# EAGLE design Shield433Rx (EAGLE 5.09)
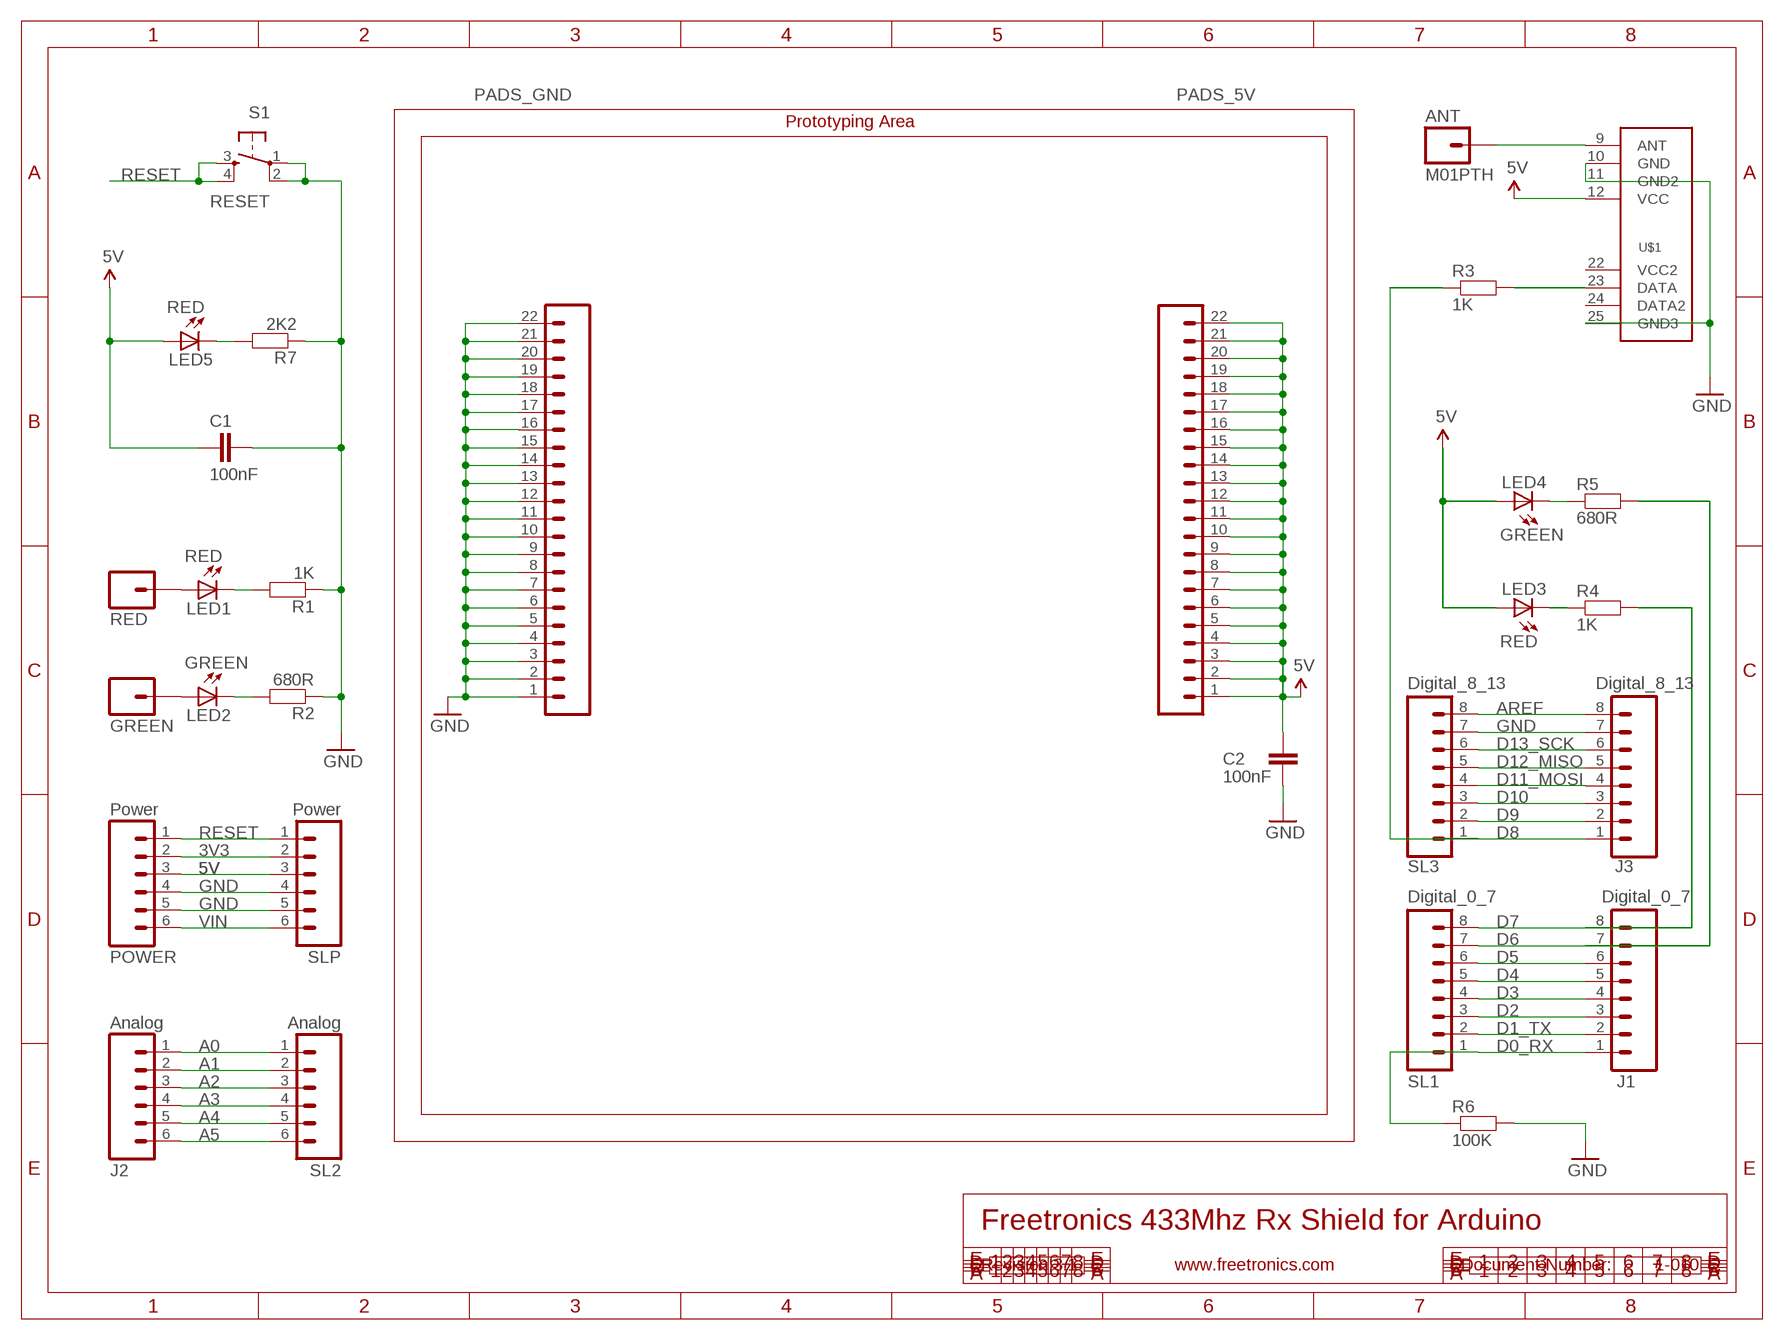
[diagram p0: schematic, sheet 1]

## Parts
ANT  M01PTH  [1X01]
C1  100nF  CAP0603  [0603]
C2  100nF  CAP0603  [0603]
GREEN  M01PTH  [1X01]
J1  Digital_0_7  M08  [1X08]
J2  Analog  M06SIP  [1X06]
J3  Digital_8_13  M08  [1X08]
LED1  RED  LED0603  [LED-0603]
LED2  GREEN  LED0603  [LED-0603]
LED3  RED  LED0603  [LED-0603]
LED4  GREEN  LED0603  [LED-0603]
LED5  RED  LED0603  [LED-0603]
PADS_5V  M22SIP-22  [SIP-22]
PADS_GND  M22SIP-22  [SIP-22]
POWER  Power  M06SIP  [1X06]
R1  1K  RESISTOR0603  [0603]
R2  680R  RESISTOR0603  [0603]
R3  1K  RESISTOR0603  [0603]
R4  1K  RESISTOR0603  [0603]
R5  680R  RESISTOR0603  [0603]
R6  100K  RESISTOR0603  [0603]
R7  2K2  RESISTOR0603  [0603]
RED  M01PTH  [1X01]
S1  RESET  BUTTON-TACTILESMT  [BUTTON-TACTILE-SMT]
SL1  Digital_0_7  M08  [1X08]
SL2  Analog  M06SIP  [1X06]
SL3  Digital_8_13  M08  [1X08]
SLP  Power  M06SIP  [1X06]
U$1  RXB1SIL  [RX-B1]

## Nets
3V3: POWER.2 SLP.2
5V: C1.1 C2.1 LED3.A LED4.A LED5.A PADS_5V.1 PADS_5V.2 PADS_5V.3 PADS_5V.4 PADS_5V.5 PADS_5V.6 PADS_5V.7 PADS_5V.8 PADS_5V.9 PADS_5V.10 PADS_5V.11 PADS_5V.12 PADS_5V.13 PADS_5V.14 PADS_5V.15 PADS_5V.16 PADS_5V.17 PADS_5V.18 PADS_5V.19 PADS_5V.20 PADS_5V.21 PADS_5V.22 POWER.3 SLP.3 U$1.12(VCC)
A0: J2.1 SL2.1
A1: J2.2 SL2.2
A2: J2.3 SL2.3
A3: J2.4 SL2.4
A4: J2.5 SL2.5
A5: J2.6 SL2.6
AREF: J3.8 SL3.8
D0_RX: J1.1 R6.1 SL1.1
D1_TX: J1.2 SL1.2
D2: J1.3 SL1.3
D3: J1.4 SL1.4
D4: J1.5 SL1.5
D5: J1.6 SL1.6
D6: J1.7 R5.2 SL1.7
D7: J1.8 R4.2 SL1.8
D8: J3.1 R3.1 SL3.1
D9: J3.2 SL3.2
D10: J3.3 SL3.3
D11_MOSI: J3.4 SL3.4
D12_MISO: J3.5 SL3.5
D13_SCK: J3.6 SL3.6
GND: C1.2 C2.2 J3.7 PADS_GND.1 PADS_GND.2 PADS_GND.3 PADS_GND.4 PADS_GND.5 PADS_GND.6 PADS_GND.7 PADS_GND.8 PADS_GND.9 PADS_GND.10 PADS_GND.11 PADS_GND.12 PADS_GND.13 PADS_GND.14 PADS_GND.15 PADS_GND.16 PADS_GND.17 PADS_GND.18 PADS_GND.19 PADS_GND.20 PADS_GND.21 PADS_GND.22 POWER.4 POWER.5 R1.1 R2.1 R6.2 R7.1 S1.1 S1.2 SL3.7 SLP.4 SLP.5 U$1.10(GND) U$1.11(GND2) U$1.25(GND3)
N$1: LED1.C R1.2
N$2: LED1.A RED.1
N$3: LED2.C R2.2
N$4: GREEN.1 LED2.A
N$6: ANT.1 U$1.9(ANT)
N$134: LED4.C R5.1
N$135: R3.2 U$1.23(DATA)
N$137: LED3.C R4.1
N$140: LED5.C R7.2
RESET: POWER.1 S1.3 S1.4 SLP.1
VIN: POWER.6 SLP.6
Unconnected: U$1.22(VCC2) U$1.24(DATA2)

## Notes on the sheet
- Prototyping Area
- Freetronics 433Mhz Rx Shield for Arduino
- Revision 3.1 | www.freetronics.com | Document Number: | 1-010

## Library data of the parts
ANT GREEN RED = freetronics:M01: Header 1 Standard 1-pin 0.1" header. Use with straight break away headers (SKU : PRT-00116), right angle break away headers (PRT-00553), swiss pins (PRT-00743), machine pins (PRT-00117), and female headers (PRT-00115).
C1 C2 = freetronics:CAP: Capacitor Standard 0603 ceramic capacitor, and 0.1" leaded capacitor.
J1 J3 SL1 SL3 = freetronics:M08: Header 8 Standard 8-pin 0.1" header. Use with straight break away headers (SKU : PRT-00116), right angle break away headers (PRT-00553), swiss pins (PRT-00743), machine pins (PRT-00117), and female headers (PRT-00115).
J2 POWER SL2 SLP = freetronics:M06: Header 6 Standard 6-pin 0.1" header. Use with straight break away headers (SKU : PRT-00116), right angle break away headers (PRT-00553), swiss pins (PRT-00743), machine pins (PRT-00117), and female headers (PRT-00115). Molex polarized connector foot print use with SKU : PRT-08094 with associated crimp pins and housings. NOTES ON THE VARIANTS LOCK and LOCK_LONGPADS... This footprint was designed to help hold the alignment of a through-hole component (i.e. 6-pin header) while soldering it into place. You may notice that each hole has been shifted either up or down by 0.005 of an inch from it's more standard position (which is a perfectly straight line). This slight alteration caused the pins (the squares in the middle) to touch the edges of the holes. Because they are alternating, it causes a "brace" to hold the component in place. 0.005 has proven to be the perfect amount of "off-center" position when using our standard breakaway headers. Although looks a little odd when you look at the bare footprint, once you have a header in there, the alteration is very hard to notice. Also, if you push a header all the way into place, it is covered up entirely on the bottom side. This idea of altering the position of holes to aid alignment will be further integrated into the Sparkfun Library for other footprints. It can help hold any component with 3 or more connection pins.
LED1-LED5 = freetronics:LED: LEDs Standard schematic elements and footprints for 5mm, 3mm, 1206, and 0603 sized LEDs. 5mm - Spark Fun Electronics SKU : COM-00529 (and others)
PADS_5V PADS_GND = PracticalArduino:M22: 22-pin SIP header
R1-R7 = freetronics:RESISTOR: Resistor Basic schematic elements and footprints for 0603, 1206, and PTH 1/10th watt (small) resistors.
S1 = PracticalArduino:BUTTON-TACTILE: Tactile push-button switch
U$1 = PracticalArduino:RXB1

## Board
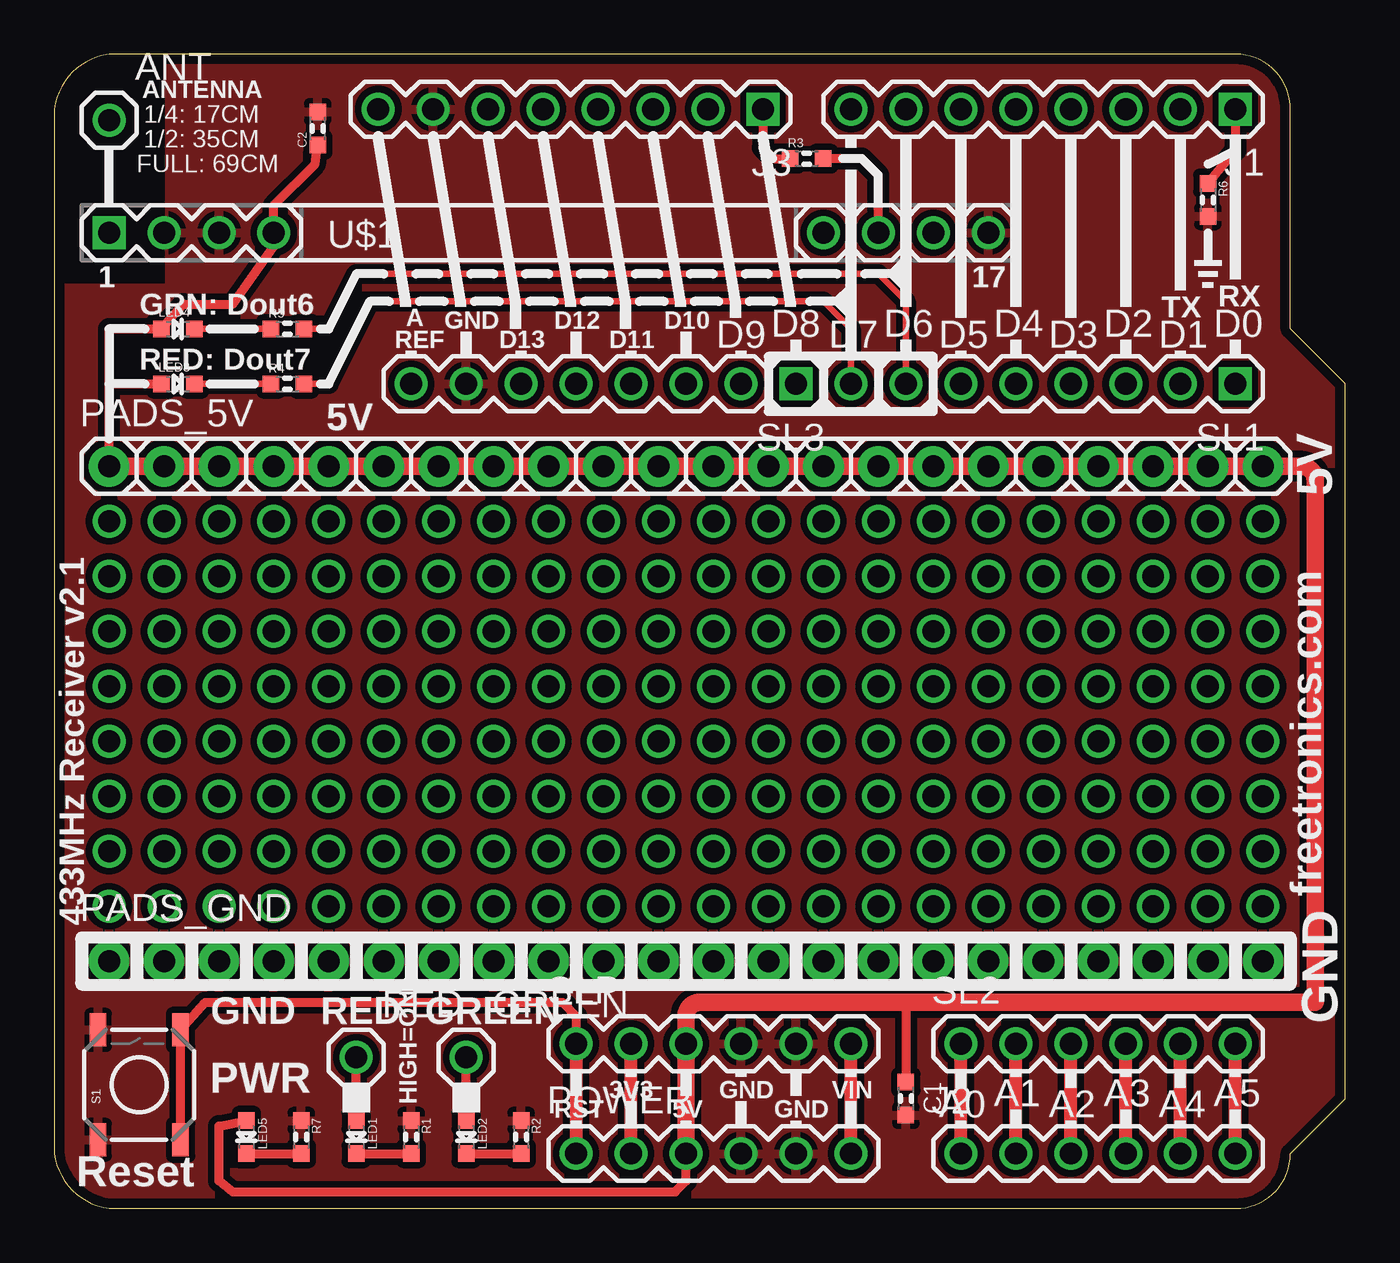
[diagram p1: board, top side]
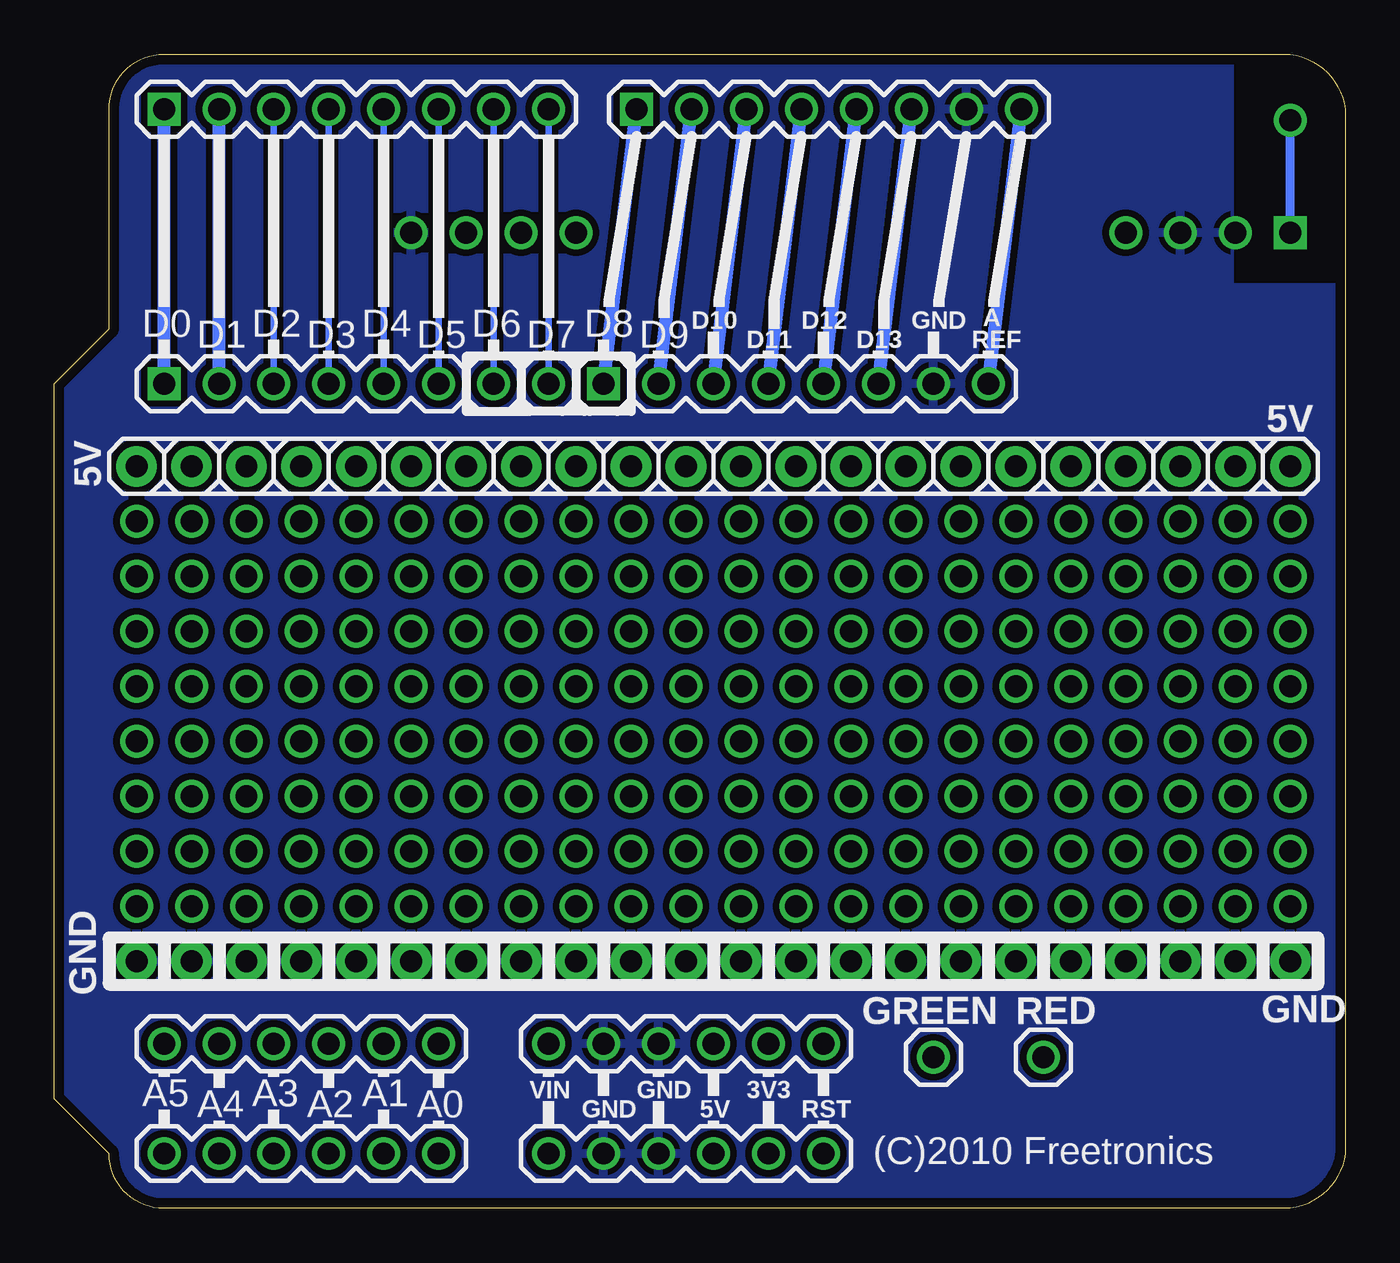
[diagram p2: board, bottom side, seen from below]

Size 59.69 x 53.34 mm. Coordinates in mm from the lower left corner, seen from the top.
Outline: 0,2.54 arc74 2.54,0 54.61,0 arc90 57.15,2.54 59.69,5.08 59.69,38.1 57.15,40.64 57.15,50.8 arc90 54.61,53.34 2.54,53.34 arc74 0,50.8 0,2.54
Copper layers (1*16): Top 0.035mm / dielectric 1.5mm / Bottom 0.035mm
Design rules "default *": minimum track width 10mil, minimum drill 24mil, track to track 12mil, track to pad 12mil, pad to pad 12mil, via to via 12mil, smd to smd 8mil, copper to edge 18mil, drill to drill 8mil, minimum pad ring 10mil, minimum via ring 8mil, stop-mask expansion 4mil, vias tented up to drill 0mil, thermal gap 10mil

### Footprints (pad centres in the part's own frame; a part is rotated, then mirrored left to right if it is on the bottom)
1X01 = drill 1.016 round: 1 0,0
0603 = smd 0.762 x 0.762: 1 -0.762,0; 2 0.762,0
1X08 = drill 1.016 square: 1 0,0 | drill 1.016 round: 2 2.54,0; 3 5.08,0; 4 7.62,0; 5 10.16,0; 6 12.7,0; 7 15.24,0; 8 17.78,0
1X06 = drill 1.016 round: 1 0,0; 2 2.54,0; 3 5.08,0; 4 7.62,0; 5 10.16,0; 6 12.7,0
LED-0603 = smd 0.762 x 0.762: A -0.762,0; C 0.762,0
SIP-22 = drill 1.016 pad 1.88 round: 1 -25.4,0; 2 -22.86,0; 3 -20.32,0; 4 -17.78,0; 5 -15.24,0; 6 -12.7,0; 7 -10.16,0; 8 -7.62,0; 9 -5.08,0; 10 -2.54,0; 11 0,0; 12 2.54,0; 13 5.08,0; 14 7.62,0; 15 10.16,0; 16 12.7,0; 17 15.24,0; 18 17.78,0; 19 20.32,0; 20 22.86,0; 21 25.4,0; 22 27.94,0
BUTTON-TACTILE-SMT = smd 1.524 x 0.762: 1 -2.54,1.905; 2 2.54,1.905; 3 -2.54,-1.905; 4 2.54,-1.905
RX-B1 = drill 1.016 square: 9 -19.05,0 | drill 1.016 round: 10 -16.51,0; 11 -13.97,0; 12 -11.43,0; 22 13.97,0; 23 16.51,0; 24 19.05,0; 25 21.59,0

### Placement (x,y rotation side)
ANT  2.54,50.29 0 top
C1  39.37,5.08 270 top
C2  12.19,49.91 90 top
GREEN  19.05,6.99 0 top
J1  54.61,50.8 180 top
J2  41.91,2.54 0 top
J3  32.77,50.8 180 top
LED1  13.97,3.3 270 top
LED2  19.05,3.3 270 top
LED3  5.71,38.1 0 top
LED4  5.71,40.64 0 top
LED5  8.89,3.3 270 top
PADS_5V  27.94,34.29 0 top
PADS_GND  27.94,11.43 0 top
POWER  24.13,2.54 0 top
R1  16.51,3.3 270 top
R2  21.59,3.3 270 top
R3  34.8,48.51 0 top
R4  10.79,38.1 0 top
R5  10.79,40.64 0 top
R6  53.34,46.61 270 top
R7  11.43,3.3 270 top
RED  13.97,6.99 0 top
S1  3.94,5.71 90 top
SL1  54.61,38.1 180 top
SL2  41.91,7.62 0 top
SL3  34.29,38.1 180 top
SLP  24.13,7.62 0 top
U$1  21.59,45.09 0 top

### Tracks (layer width: path | path; a pad name or v marks a point on that pad's centre or on a via)
3V3
  Top 0.61: POWER.2 SLP.2
5V
  Top 0.305: 3.81,34.29 4.06,34.54
  Top 0.406: 12.06,49.28 C2.1 12.06,48.26 10.16,46.35 U$1.12 10.16,44.45 8.26,41.78 5.97,41.78 LED4.A 2.54,40.64 2.54,38.1 | PADS_5V.1 2.54,38.1 | 2.54,38.1 LED3.A | 39.37,9.53 C1.1 | POWER.3 29.21,1.27 28.7,0.76 8.26,0.76 7.62,1.27 7.62,3.81 LED5.A
  Top 0.813: POWER.3 SLP.3 29.21,8.89 arc-90 29.84,9.53 39.37,9.53 58.29,9.53 58.29,33.66 arc90 57.66,34.29 PADS_5V.22 PADS_5V.21 PADS_5V.20 PADS_5V.19 PADS_5V.18 PADS_5V.17 PADS_5V.16 PADS_5V.15 PADS_5V.14 PADS_5V.13 PADS_5V.12 PADS_5V.11 PADS_5V.10 PADS_5V.9 PADS_5V.8 PADS_5V.7 PADS_5V.6 PADS_5V.5 PADS_5V.4 PADS_5V.3 PADS_5V.2 PADS_5V.1 3.81,34.29
A0
  Top 0.61: J2.1 SL2.1
A1
  Top 0.61: J2.2 SL2.2
A2
  Top 0.61: J2.3 SL2.3
A3
  Top 0.61: J2.4 SL2.4
A4
  Top 0.61: J2.5 SL2.5
A5
  Top 0.61: J2.6 SL2.6
AREF
  Bottom 0.61: SL3.8 J3.8
D0_RX
  Top 0.406: R6.1 54.61,48.9 J1.1
  Bottom 0.61: SL1.1 J1.1
D1_TX
  Bottom 0.61: SL1.2 J1.2
D2
  Bottom 0.305: SL1.3 J1.3
D3
  Bottom 0.305: SL1.4 J1.4
D4
  Bottom 0.305: SL1.5 J1.5
D5
  Bottom 0.305: SL1.6 J1.6
D6
  Top 0.305: SL1.7 39.37,41.91 38.1,43.18 13.97,43.18 12.7,40.64 R5.2
  Bottom 0.305: SL1.7 J1.7
D7
  Top 0.305: R4.2 12.7,38.1 14.61,41.91 35.56,41.91 36.83,40.64 SL1.8
  Bottom 0.305: SL1.8 J1.8
D8
  Top 0.406: J3.1 32.77,49.02 33.27,48.51 R3.1
  Bottom 0.61: SL3.1 J3.1
D9
  Bottom 0.61: SL3.2 J3.2
D10
  Bottom 0.61: SL3.3 J3.3
D11_MOSI
  Bottom 0.61: SL3.4 J3.4
D12_MISO
  Bottom 0.61: SL3.5 J3.5
D13_SCK
  Bottom 0.61: SL3.6 J3.6
GND
  pour Bottom: 0,42.55 5.33,42.55 5.33,53.34 54.61,53.34 arc-74 57.15,50.8 57.15,40.64 59.69,38.1 59.69,5.08 57.15,2.54 arc-74 54.61,0 2.54,0 arc-74 0,2.54
  pour Top: 0,42.55 5.33,42.55 5.33,53.34 54.61,53.34 arc-74 57.15,50.8 57.15,40.64 59.69,38.1 59.69,5.08 57.15,2.54 arc-74 54.61,0 2.54,0 arc-74 0,2.54
N$1
  Top 0.406: LED1.C R1.2
N$2
  Top 0.406: LED1.A RED.1
N$3
  Top 0.406: LED2.C R2.2
N$4
  Top 0.406: LED2.A GREEN.1
N$5  (via drill 1.02)
  other vias: 50.8,13.97
N$6
  Bottom 0.406: U$1.9 ANT.1
N$7  (via drill 1.02)
  other vias: 48.26,13.97
N$8  (via drill 1.02)
  other vias: 45.72,13.97
N$9  (via drill 1.02)
  other vias: 43.18,13.97
N$10  (via drill 1.02)
  other vias: 40.64,13.97
N$11  (via drill 1.02)
  other vias: 38.1,13.97
N$12  (via drill 1.02)
  other vias: 35.56,13.97
N$13  (via drill 1.02)
  other vias: 33.02,13.97
N$14  (via drill 1.02)
  other vias: 30.48,13.97
N$15  (via drill 1.02)
  other vias: 27.94,13.97
N$16  (via drill 1.02)
  other vias: 25.4,13.97
N$17  (via drill 1.02)
  other vias: 22.86,13.97
N$18  (via drill 1.02)
  other vias: 20.32,13.97
N$19  (via drill 1.02)
  other vias: 17.78,13.97
N$20  (via drill 1.02)
  other vias: 15.24,13.97
N$21  (via drill 1.02)
  other vias: 12.7,13.97
N$22  (via drill 1.02)
  other vias: 50.8,16.51
N$23  (via drill 1.02)
  other vias: 48.26,16.51
N$24  (via drill 1.02)
  other vias: 45.72,16.51
N$25  (via drill 1.02)
  other vias: 43.18,16.51
N$26  (via drill 1.02)
  other vias: 40.64,16.51
N$27  (via drill 1.02)
  other vias: 38.1,16.51
N$28  (via drill 1.02)
  other vias: 35.56,16.51
N$29  (via drill 1.02)
  other vias: 33.02,16.51
N$30  (via drill 1.02)
  other vias: 30.48,16.51
N$31  (via drill 1.02)
  other vias: 27.94,16.51
N$32  (via drill 1.02)
  other vias: 25.4,16.51
N$33  (via drill 1.02)
  other vias: 22.86,16.51
N$34  (via drill 1.02)
  other vias: 20.32,16.51
N$35  (via drill 1.02)
  other vias: 17.78,16.51
N$36  (via drill 1.02)
  other vias: 15.24,16.51
N$37  (via drill 1.02)
  other vias: 12.7,16.51
N$38  (via drill 1.02)
  other vias: 50.8,19.05
N$39  (via drill 1.02)
  other vias: 48.26,19.05
N$40  (via drill 1.02)
  other vias: 45.72,19.05
N$41  (via drill 1.02)
  other vias: 43.18,19.05
N$42  (via drill 1.02)
  other vias: 40.64,19.05
N$43  (via drill 1.02)
  other vias: 38.1,19.05
N$44  (via drill 1.02)
  other vias: 35.56,19.05
N$45  (via drill 1.02)
  other vias: 33.02,19.05
N$46  (via drill 1.02)
  other vias: 30.48,19.05
N$47  (via drill 1.02)
  other vias: 27.94,19.05
N$48  (via drill 1.02)
  other vias: 25.4,19.05
N$49  (via drill 1.02)
  other vias: 22.86,19.05
N$50  (via drill 1.02)
  other vias: 20.32,19.05
N$51  (via drill 1.02)
  other vias: 17.78,19.05
N$52  (via drill 1.02)
  other vias: 15.24,19.05
N$53  (via drill 1.02)
  other vias: 12.7,19.05
N$54  (via drill 1.02)
  other vias: 50.8,21.59
N$55  (via drill 1.02)
  other vias: 48.26,21.59
N$56  (via drill 1.02)
  other vias: 45.72,21.59
N$57  (via drill 1.02)
  other vias: 43.18,21.59
N$58  (via drill 1.02)
  other vias: 40.64,21.59
N$59  (via drill 1.02)
  other vias: 38.1,21.59
N$60  (via drill 1.02)
  other vias: 35.56,21.59
N$61  (via drill 1.02)
  other vias: 33.02,21.59
N$62  (via drill 1.02)
  other vias: 30.48,21.59
N$63  (via drill 1.02)
  other vias: 27.94,21.59
N$64  (via drill 1.02)
  other vias: 25.4,21.59
N$65  (via drill 1.02)
  other vias: 22.86,21.59
N$66  (via drill 1.02)
  other vias: 20.32,21.59
N$67  (via drill 1.02)
  other vias: 17.78,21.59
N$68  (via drill 1.02)
  other vias: 15.24,21.59
N$69  (via drill 1.02)
  other vias: 12.7,21.59
N$70  (via drill 1.02)
  other vias: 50.8,24.13
N$71  (via drill 1.02)
  other vias: 48.26,24.13
N$72  (via drill 1.02)
  other vias: 45.72,24.13
N$73  (via drill 1.02)
  other vias: 43.18,24.13
N$74  (via drill 1.02)
  other vias: 40.64,24.13
N$75  (via drill 1.02)
  other vias: 38.1,24.13
N$76  (via drill 1.02)
  other vias: 35.56,24.13
N$77  (via drill 1.02)
  other vias: 33.02,24.13
N$78  (via drill 1.02)
  other vias: 30.48,24.13
N$79  (via drill 1.02)
  other vias: 27.94,24.13
N$80  (via drill 1.02)
  other vias: 25.4,24.13
N$81  (via drill 1.02)
  other vias: 22.86,24.13
N$82  (via drill 1.02)
  other vias: 20.32,24.13
N$83  (via drill 1.02)
  other vias: 17.78,24.13
N$84  (via drill 1.02)
  other vias: 15.24,24.13
N$85  (via drill 1.02)
  other vias: 12.7,24.13
N$86  (via drill 1.02)
  other vias: 50.8,26.67
N$87  (via drill 1.02)
  other vias: 48.26,26.67
N$88  (via drill 1.02)
  other vias: 45.72,26.67
N$89  (via drill 1.02)
  other vias: 43.18,26.67
N$90  (via drill 1.02)
  other vias: 40.64,26.67
N$91  (via drill 1.02)
  other vias: 38.1,26.67
N$92  (via drill 1.02)
  other vias: 35.56,26.67
N$93  (via drill 1.02)
  other vias: 33.02,26.67
N$94  (via drill 1.02)
  other vias: 30.48,26.67
N$95  (via drill 1.02)
  other vias: 27.94,26.67
N$96  (via drill 1.02)
  other vias: 25.4,26.67
N$97  (via drill 1.02)
  other vias: 22.86,26.67
N$98  (via drill 1.02)
  other vias: 20.32,26.67
N$99  (via drill 1.02)
  other vias: 17.78,26.67
N$100  (via drill 1.02)
  other vias: 15.24,26.67
N$101  (via drill 1.02)
  other vias: 12.7,26.67
N$102  (via drill 1.02)
  other vias: 50.8,29.21
N$103  (via drill 1.02)
  other vias: 48.26,29.21
N$104  (via drill 1.02)
  other vias: 45.72,29.21
N$105  (via drill 1.02)
  other vias: 43.18,29.21
N$106  (via drill 1.02)
  other vias: 40.64,29.21
N$107  (via drill 1.02)
  other vias: 38.1,29.21
N$108  (via drill 1.02)
  other vias: 35.56,29.21
N$109  (via drill 1.02)
  other vias: 33.02,29.21
N$110  (via drill 1.02)
  other vias: 30.48,29.21
N$111  (via drill 1.02)
  other vias: 27.94,29.21
N$112  (via drill 1.02)
  other vias: 25.4,29.21
N$113  (via drill 1.02)
  other vias: 22.86,29.21
N$114  (via drill 1.02)
  other vias: 20.32,29.21
N$115  (via drill 1.02)
  other vias: 17.78,29.21
N$116  (via drill 1.02)
  other vias: 15.24,29.21
N$117  (via drill 1.02)
  other vias: 12.7,29.21
N$118  (via drill 1.02)
  other vias: 50.8,31.75
N$119  (via drill 1.02)
  other vias: 48.26,31.75
N$120  (via drill 1.02)
  other vias: 45.72,31.75
N$121  (via drill 1.02)
  other vias: 43.18,31.75
N$122  (via drill 1.02)
  other vias: 40.64,31.75
N$123  (via drill 1.02)
  other vias: 38.1,31.75
N$124  (via drill 1.02)
  other vias: 35.56,31.75
N$125  (via drill 1.02)
  other vias: 33.02,31.75
N$126  (via drill 1.02)
  other vias: 30.48,31.75
N$127  (via drill 1.02)
  other vias: 27.94,31.75
N$128  (via drill 1.02)
  other vias: 25.4,31.75
N$129  (via drill 1.02)
  other vias: 22.86,31.75
N$130  (via drill 1.02)
  other vias: 20.32,31.75
N$131  (via drill 1.02)
  other vias: 17.78,31.75
N$132  (via drill 1.02)
  other vias: 15.24,31.75
N$133  (via drill 1.02)
  other vias: 12.7,31.75
N$134
  Top 0.305: LED4.C R5.1
N$135
  Top 0.406: R3.2 37.34,48.51 38.1,47.75 U$1.23
N$137
  Top 0.305: LED3.C R4.1
N$140
  Top 0.406: LED5.C R7.2
N$182  (via drill 1.02)
  other vias: 53.34,13.97
N$183  (via drill 1.02)
  other vias: 53.34,16.51
N$184  (via drill 1.02)
  other vias: 53.34,19.05
N$185  (via drill 1.02)
  other vias: 53.34,21.59
N$186  (via drill 1.02)
  other vias: 53.34,24.13
N$187  (via drill 1.02)
  other vias: 53.34,26.67
N$188  (via drill 1.02)
  other vias: 53.34,29.21
N$189  (via drill 1.02)
  other vias: 53.34,31.75
N$193  (via drill 1.02)
  other vias: 55.88,13.97
N$194  (via drill 1.02)
  other vias: 55.88,16.51
N$195  (via drill 1.02)
  other vias: 55.88,19.05
N$196  (via drill 1.02)
  other vias: 55.88,21.59
N$197  (via drill 1.02)
  other vias: 55.88,24.13
N$198  (via drill 1.02)
  other vias: 55.88,26.67
N$199  (via drill 1.02)
  other vias: 55.88,29.21
N$200  (via drill 1.02)
  other vias: 55.88,31.75
N$204  (via drill 1.02)
  other vias: 10.16,13.97
N$205  (via drill 1.02)
  other vias: 10.16,16.51
N$206  (via drill 1.02)
  other vias: 10.16,19.05
N$207  (via drill 1.02)
  other vias: 10.16,21.59
N$208  (via drill 1.02)
  other vias: 10.16,24.13
N$209  (via drill 1.02)
  other vias: 10.16,26.67
N$210  (via drill 1.02)
  other vias: 10.16,29.21
N$211  (via drill 1.02)
  other vias: 10.16,31.75
N$215  (via drill 1.02)
  other vias: 7.62,13.97
N$216  (via drill 1.02)
  other vias: 7.62,16.51
N$217  (via drill 1.02)
  other vias: 7.62,19.05
N$218  (via drill 1.02)
  other vias: 7.62,21.59
N$219  (via drill 1.02)
  other vias: 7.62,24.13
N$220  (via drill 1.02)
  other vias: 7.62,26.67
N$221  (via drill 1.02)
  other vias: 7.62,29.21
N$222  (via drill 1.02)
  other vias: 7.62,31.75
N$226  (via drill 1.02)
  other vias: 5.08,13.97
N$227  (via drill 1.02)
  other vias: 5.08,16.51
N$228  (via drill 1.02)
  other vias: 5.08,19.05
N$229  (via drill 1.02)
  other vias: 5.08,21.59
N$230  (via drill 1.02)
  other vias: 5.08,24.13
N$231  (via drill 1.02)
  other vias: 5.08,26.67
N$232  (via drill 1.02)
  other vias: 5.08,29.21
N$233  (via drill 1.02)
  other vias: 5.08,31.75
N$237  (via drill 1.02)
  other vias: 2.54,13.97
N$238  (via drill 1.02)
  other vias: 2.54,16.51
N$239  (via drill 1.02)
  other vias: 2.54,19.05
N$240  (via drill 1.02)
  other vias: 2.54,21.59
N$241  (via drill 1.02)
  other vias: 2.54,24.13
N$242  (via drill 1.02)
  other vias: 2.54,26.67
N$243  (via drill 1.02)
  other vias: 2.54,29.21
N$244  (via drill 1.02)
  other vias: 2.54,31.75
RESET
  Top 0.406: SLP.1 24.13,8.89 23.5,9.53 6.99,9.53 S1.4 S1.3
  Top 0.61: SLP.1 POWER.1 SLP.1
VIN
  Top 0.61: POWER.6 SLP.6

### Text on the board
tPlace: ANTENNA | 1/4: 17CM | 1/2: 35CM | FULL: 69CM | 1 | 17 | RX | GRN: Dout6 | A | GND | D12 | D10 | TX | REF | D13 | D11 | D9 | D8 | D7 | D6 | D5 | D4 | D3 | D2 | D1 | D0 | RED: Dout7 | 5V | 5V | freetronics.com | 433MHz Receiver v2.1 | GND | RED | GREEN | GND | PWR | HIGH=ON | 3V3 | GND | VIN | A1 | A3 | A5 | RST | 5V | GND | A0 | A2 | A4 | Reset
bPlace: A | GND | D12 | D10 | REF | D13 | D11 | D9 | D8 | D7 | D6 | D5 | D4 | D3 | D2 | D1 | D0 | 5V | 5V | GND | GND | RED | GREEN | 3V3 | GND | VIN | A1 | A3 | A5 | RST | 5V | GND | A0 | A2 | A4 | (C)2010 Freetronics